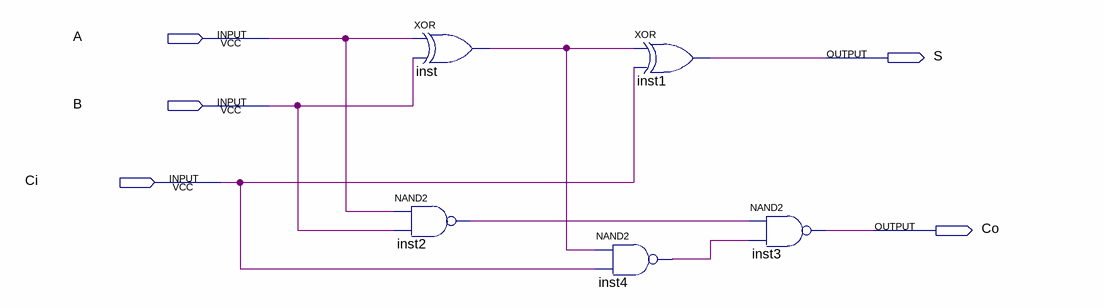
[diagram p0: schematic sheet]
// Quartus schematic lab5.bdf as structural Verilog: 5 symbols, 5 pins
module lab5 (
  input  A,
  input  B,
  input  Ci,
  output S,
  output Co
);

  wire inst2_out, inst4_out, inst_out;

  xor inst (inst_out, A, B);
  nand inst2 (inst2_out, A, B);
  xor inst1 (S, inst_out, Ci);
  nand inst4 (inst4_out, inst_out, Ci);
  nand inst3 (Co, inst2_out, inst4_out);
endmodule
